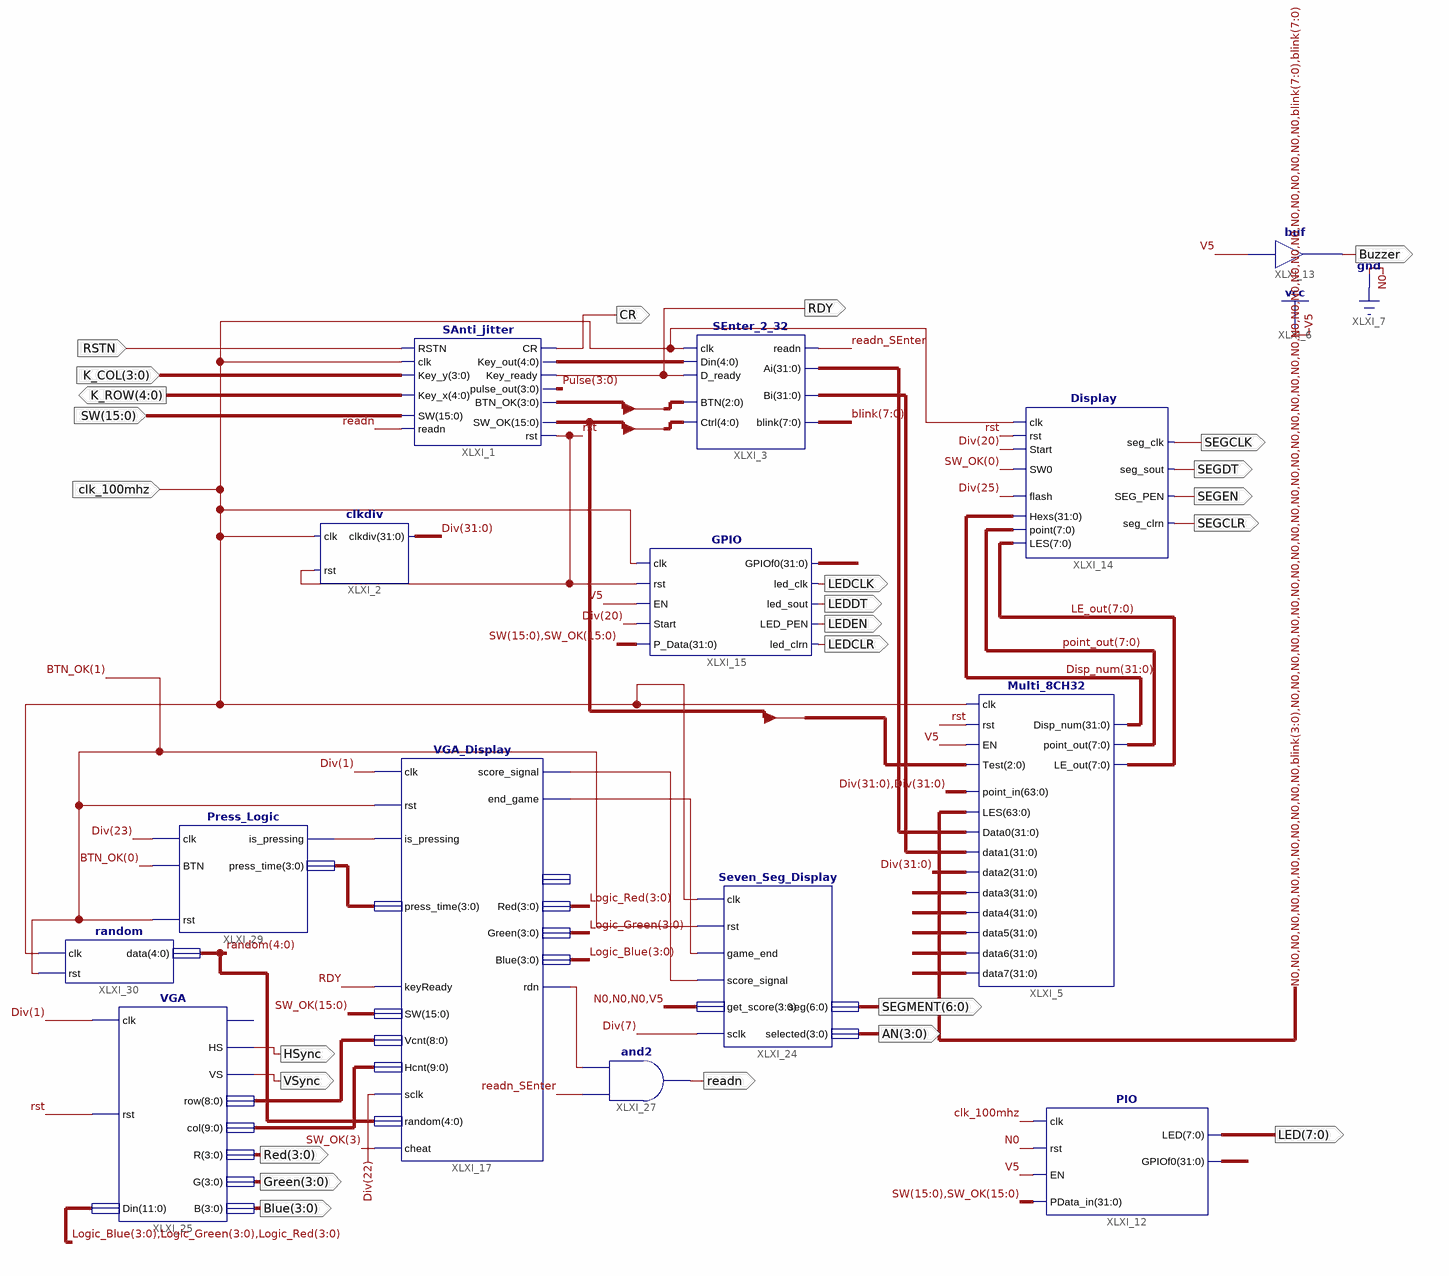
[diagram p0: schematic sheet 1]
// Xilinx ISE schematic framework_sch.sch (kintex7) as structural Verilog: 14 symbols, 25 ports
module framework_sch (
  input  clk_100mhz,
  input  [15:0] SW,
  input  [3:0] K_COL,
  input  RSTN,
  output Buzzer,
  output LEDCLR,
  output LEDEN,
  output LEDDT,
  output LEDCLK,
  output RDY,
  output CR,
  output [4:0] K_ROW,
  output SEGCLK,
  output SEGDT,
  output SEGEN,
  output SEGCLR,
  output [6:0] SEGMENT,
  output [3:0] AN,
  output [3:0] Green,
  output [3:0] Blue,
  output [3:0] Red,
  output VSync,
  output HSync,
  output readn,
  output [7:0] LED
);

  wire readn_SEnter, rst, XLXN_113, XLXN_125, XLXN_126, XLXN_143;
  wire [3:0] BTN_OK, Logic_Blue, Logic_Green, Logic_Red, Pulse, XLXN_114;
  wire [4:0] random, XLXN_11;
  wire [7:0] blink, LE_out, point_out;
  wire [8:0] XLXN_138;
  wire [9:0] XLXN_139;
  wire [15:0] SW_OK;
  wire [31:0] Disp_num, Div, XLXN_94, XLXN_95, XLXN_100, XLXN_101, XLXN_102, XLXN_103, XLXN_105, XLXN_179,
       XLXN_180;

  Multi_8CH32 XLXI_5 (
    .Test(SW_OK[7:5]), .point_in({Div, Div}), .EN(1'b1), .clk(clk_100mhz), .rst(rst),
    .LES({{12{1'b0}}, blink[3:0], {32{1'b0}}, blink, blink}), .Data0(XLXN_94), .data1(XLXN_95), .data2(Div),
    .data3(XLXN_100), .data4(XLXN_101), .data5(XLXN_102), .data6(XLXN_103), .data7(XLXN_105),
    .point_out(point_out), .LE_out(LE_out), .Disp_num(Disp_num));
  buf XLXI_13 (Buzzer, 1'b1);
  clkdiv XLXI_2 (.rst(rst), .clkdiv(Div), .clk(clk_100mhz));
  GPIO XLXI_15 (
    .clk(clk_100mhz), .P_Data({SW, SW_OK}), .rst(rst), .EN(1'b1), .Start(Div[20]), .led_clrn(LEDCLR),
    .GPIOf0(XLXN_180), .led_clk(LEDCLK), .led_sout(LEDDT), .LED_PEN(LEDEN));
  SEnter_2_32 XLXI_3 (
    .readn(readn_SEnter), .Ai(XLXN_94), .Bi(XLXN_95), .blink(blink), .Din(XLXN_11), .D_ready(RDY),
    .clk(clk_100mhz), .Ctrl({SW_OK[7:5], SW_OK[15], SW_OK[0]}), .BTN(BTN_OK[2:0]));
  SAnti_jitter XLXI_1 (
    .SW(SW), .readn(readn), .Key_y(K_COL), .Key_x(K_ROW), .RSTN(RSTN), .clk(clk_100mhz), .Key_out(XLXN_11),
    .Key_ready(RDY), .CR(CR), .rst(rst), .SW_OK(SW_OK), .pulse_out(Pulse), .BTN_OK(BTN_OK));
  Display XLXI_14 (
    .LES(LE_out), .SEG_PEN(SEGEN), .seg_sout(SEGDT), .seg_clrn(SEGCLR), .point(point_out), .Hexs(Disp_num),
    .SW0(SW_OK[0]), .flash(Div[25]), .seg_clk(SEGCLK), .clk(clk_100mhz), .rst(rst), .Start(Div[20]));
  Seven_Seg_Display XLXI_24 (
    .clk(clk_100mhz), .rst(BTN_OK[1]), .game_end(XLXN_126), .score_signal(XLXN_125), .get_score(4'b0001),
    .seg(SEGMENT), .sclk(Div[7]), .selected(AN));
  VGA_Display XLXI_17 (
    .clk(Div[1]), .rst(BTN_OK[1]), .keyReady(RDY), .sclk(Div[22]), .is_pressing(XLXN_113),
    .press_time(XLXN_114), .SW(SW_OK), .Vcnt(XLXN_138), .Hcnt(XLXN_139), .random(random),
    .score_signal(XLXN_125), .end_game(XLXN_126), .rdn(XLXN_143), .Red(Logic_Red), .Green(Logic_Green),
    .Blue(Logic_Blue), .cheat(SW_OK[3]));  // open: get_score
  VGA XLXI_25 (
    .clk(Div[1]), .rst(rst), .Din({Logic_Blue, Logic_Green, Logic_Red}), .HS(HSync), .VS(VSync),
    .row(XLXN_138), .col(XLXN_139), .R(Red), .G(Green), .B(Blue));  // open: rdn
  and XLXI_27 (readn, readn_SEnter, XLXN_143);
  Press_Logic XLXI_29 (.clk(Div[23]), .rst(BTN_OK[1]), .BTN(BTN_OK[0]), .is_pressing(XLXN_113), .press_time(XLXN_114));
  random XLXI_30 (.clk(clk_100mhz), .data(random), .rst(BTN_OK[1]));
  PIO XLXI_12 (.clk(clk_100mhz), .rst(1'b0), .EN(1'b1), .PData_in({SW, SW_OK}), .GPIOf0(XLXN_179), .LED(LED));
endmodule
